# EasyEDA Pro project esp-streamer-schematics.epro

# Schematic Schematic1
Board Name: Board1; Create Date: 2025-04-21; Page Name: P1; Project Name: esp-streamer; Schematic Name: Schematic1; Update Date: 2025-04-25; Company: EasyEDA.com; Page Size: A4; Version: V1.0
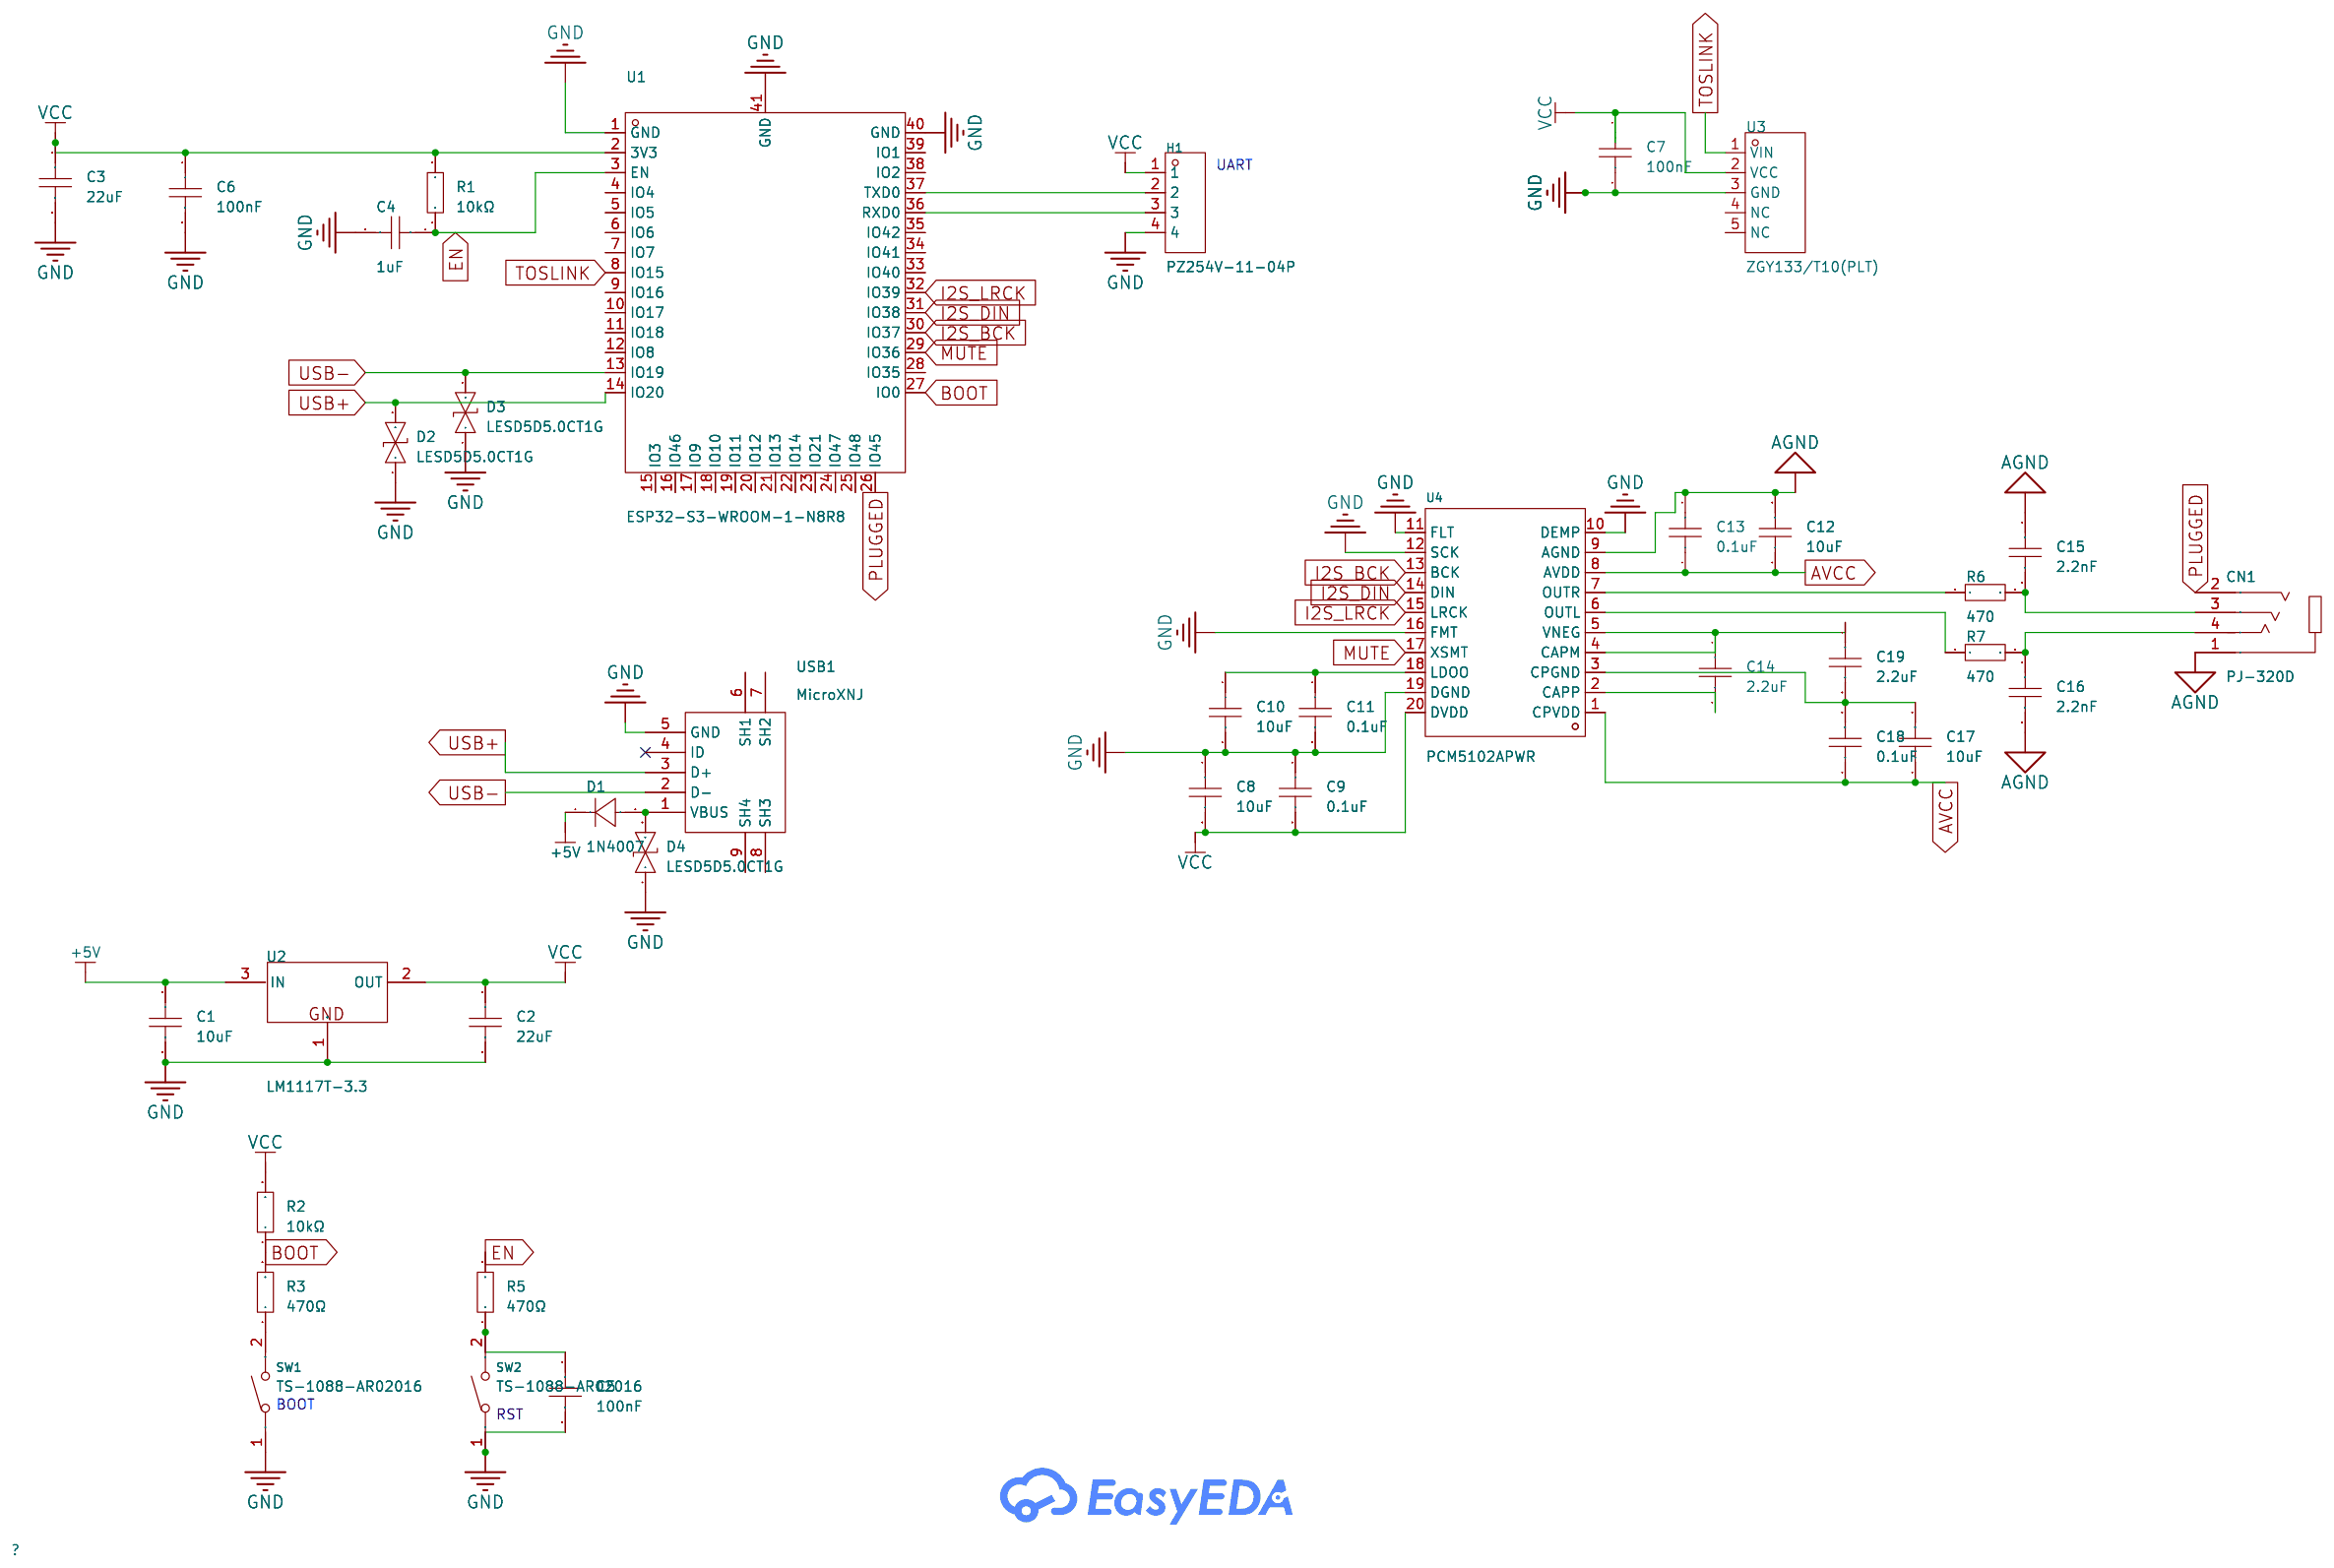
[diagram p0: schematic sheet]

## Parts
C1  10uF  [C0603]
C2  22uF  [C0603]
C3  22uF  [C0603]
C4  1uF  [C0603]
C5  100nF  [C0603]
C6  100nF  [C0603]
C7  100nF  [C0603]
C8  10uF  [C0603]
C9  0.1uF  [C0603]
C10  10uF  [C0603]
C11  0.1uF  [C0603]
C12  10uF  [C0603]
C13  0.1uF  [C0603]
C14  2.2uF  [C0603]
C15  2.2nF  [C0603]
C16  2.2nF  [C0603]
C17  10uF  [C0603]
C18  0.1uF  [C0603]
C19  2.2uF  [C0603]
CN1  PJ-320D  [AUDIO-SMD_PJ-320D]
D1  1N4007  [DO-41_BD2.4-L4.7-P8.70-D0.9-RD]
D2  LESD5D5.0CT1G  [SOD-523_L1.2-W0.8-LS1.6-BI]
D3  LESD5D5.0CT1G  [SOD-523_L1.2-W0.8-LS1.6-BI]
D4  LESD5D5.0CT1G  [SOD-523_L1.2-W0.8-LS1.6-BI]
H1  PZ254V-11-04P  [HDR-TH_4P-P2.54-V-M]
R1  10kΩ  [R0603]
R2  10kΩ  [R0603]
R3  470Ω  [R0603]
R5  470Ω  [R0603]
R6  470  [R0603]
R7  470  [R0603]
SW1  TS-1088-AR02016  [SW-SMD_L3.9-W3.0-P4.45]
SW2  TS-1088-AR02016  [SW-SMD_L3.9-W3.0-P4.45]
U1  ESP32-S3-WROOM-1-N8R8  [WIRELM-SMD_ESP32-S3-WROOM-1]
U2  LM1117T-3.3  [TO-220-3_L10.0-W4.5-P2.54-L]
U3  ZGY133/T10(PLT)  [COMM-TH_ZGY133-T10-PLT]
U4  PCM5102APWR  [TSSOP-20_L6.5-W4.4-P0.65-LS6.4-BL]
USB1  MicroXNJ  [MICRO-USB-SMD_MICROXNJ]

## Library data of the parts
C1 = CL10A106KP8NNNC: Capacitance: Tolerance:±10% Tolerance:±10% Voltage Rated: Temperature Coefficient:; LCSC Part Name: 10uF ±10% 10V; Supplier Part: C19702; Manufacturer: SAMSUNG(三星); Supplier Footprint: 0603; JLCPCB Part Class: Basic Part; Datasheet: https://atta.szlcsc.com/upload/public/pdf/source/20160218/1457707763339.pdf; Supplier: LCSC; Tolerance: ±10%
C2 C3 = CL10A226MQ8NRNC: Capacitance: Tolerance:±20% Tolerance:±20% Voltage Rated: Temperature Coefficient:; LCSC Part Name: 22uF ±20% 6.3V; Supplier Part: C59461; Manufacturer: SAMSUNG(三星); Supplier Footprint: 0603; JLCPCB Part Class: Basic Part; Datasheet: https://atta.szlcsc.com/upload/public/pdf/source/20160218/1457707763339.pdf; Supplier: LCSC; Tolerance: ±20%
C4 = CL10A105KB8NNNC: Capacitance: Tolerance:±10% Tolerance:±10% Voltage Rated: Temperature Coefficient:; LCSC Part Name: 1uF ±10% 50V; Supplier Part: C15849; Manufacturer: SAMSUNG(三星); Supplier Footprint: 0603; JLCPCB Part Class: Basic Part; Datasheet: https://atta.szlcsc.com/upload/public/pdf/source/20160218/1457707763339.pdf; Supplier: LCSC; Tolerance: ±10%
C5-C7 = CC0603KRX7R9BB104: Capacitance: Tolerance:±10% Tolerance:±10% Voltage Rated: Temperature Coefficient:; LCSC Part Name: 100nF ±10% 50V; Supplier Part: C14663; Manufacturer: YAGEO(国巨); Supplier Footprint: 0603; JLCPCB Part Class: Basic Part; Datasheet: https://atta.szlcsc.com/upload/public/pdf/source/20180910/C282072_33301C7F631E79921B82A8DAC6BCC5B3.pdf; Supplier: LCSC; Tolerance: ±10%
C8-C19 = CAP_0603: Supplier Footprint: 0603
CN1 = PJ-320D_C431535: Connector Type:3.5mm Headphone Jack Current Rating (Max):500mA Voltage Rating (Max):50V Contact Material:Copper Contact Plating:Silver Operating Temperature Range:-30℃~+70℃ Operating Temperature Range:-30℃~+70℃; LCSC Part Name: 3.5mm耳机座; Supplier Part: C431535; Manufacturer: SHOU HAN(首韩); Supplier Footprint: SMD; JLCPCB Part Class: Extended Part; Datasheet: https://atta.szlcsc.com/upload/public/pdf/source/20190925/C431535_8B274506621F6117FB020BF07A197848.pdf; Supplier: LCSC; Connector Type: 3.5mm Headphone Jack; Current Rating (Max): 500mA; Voltage Rating (Max): 50V; Contact Material: Copper; Contact Plating: Silver; Operating Temperature Range: -30℃~+70℃
D1 = 1N4007_C5280502: Voltage - Forward(Vf@If):- Voltage - DC Reverse(Vr):1kV Current - Rectified: Reverse Leakage Current (Ir):5uA; Supplier Part: C5280502; Manufacturer: XCH(旭昌辉); Supplier Footprint: DO-41; JLCPCB Part Class: Extended Part; Datasheet: https://atta.szlcsc.com/upload/public/pdf/source/20221209/078A147425187CB18B07AE1D756AAC46.pdf; Supplier: LCSC; Voltage - DC Reverse(Vr): 1kV; Reverse Leakage Current (Ir): 5uA
D2-D4 = LESD5D5.0CT1G: polarity:Bidirectional Reverse Stand-Off Voltage (Vrwm):5V Maximum Clamping Voltage:18.6V Peak Pulse Current (Ipp):9.4A Breakdown Voltage:5.6V Type:ESD; LCSC Part Name: 双向ESD; Supplier Part: C383211; Manufacturer: LRC(乐山无线电); Supplier Footprint: SOD-523; JLCPCB Part Class: Extended Part; Datasheet: https://atta.szlcsc.com/upload/public/pdf/source/20190807/C383211_633DF4B4E2C161403226E5235FE33A1C.pdf; Supplier: LCSC; polarity: Bidirectional; Reverse Stand-Off Voltage (Vrwm): 5V; Maximum Clamping Voltage: 18.6V; Peak Pulse Current (Ipp): 9.4A; Breakdown Voltage: 5.6V; Type: ESD
H1 = PZ254V-11-04P: Pin Structure:1x4P Pitch:2.54mm Row Spacing:- Circluar Pins/Square Pins:Square Pins Mounting Type:Straight Number of Rows:Plugin Number of Pins:4P Current Rating (Max):3A Voltage Rating (Max):250V Length of Mating Pin:6mm Insulation Height:2.5mm Length of; LCSC Part Name: 间距:2.54mm 1x4P 直插 方针; Supplier Part: C2691448; Manufacturer: XFCN(兴飞); Supplier Footprint: 插件,P=2.54mm; JLCPCB Part Class: Extended Part; Datasheet: https://atta.szlcsc.com/upload/public/pdf/source/20200309/C492403_F9F19131791D08044AD4F84F8E751A34.pdf; Supplier: LCSC; Pin Structure: 1x4P; Pitch: 2.54mm; Circluar Pins/Square Pins: Square Pins; Mounting Type: Straight; Number of Rows: Plugin; Number of Pins: 4P; Current Rating (Max): 3A; Voltage Rating (Max): 250V; Length of Mating Pin: 6mm; Insulation Height: 2.5mm; Length of End Connection Pin: 3mm; Operating Temperature Range: -40℃~+105℃; Color: Black
R1 R2 = 0603WAF1002T5E: Type:Thick Film Resistors Resistance:10kΩ Tolerance:±1% Tolerance:±1% Power(Watts): Overload Voltage (Max): Temperature Coefficient:±100ppm/℃ Temperature Coefficient:±100ppm/℃ Operating Temperature Range:-55℃~+155℃ Operating Temperature Range:-55℃~+155℃; LCSC Part Name: 厚膜电阻 10kΩ ±1% 100mW; Supplier Part: C25804; Manufacturer: UNI-ROYAL(厚声); Supplier Footprint: 0603; JLCPCB Part Class: Basic Part; Datasheet: https://atta.szlcsc.com/upload/public/pdf/source/20200306/C422600_1E6D84923E4A46A82E41ADD87F860B5C.pdf; Supplier: LCSC; Type: Thick Film Resistors; Tolerance: ±1%; Temperature Coefficient: ±100ppm/℃; Operating Temperature Range: -55℃~+155℃
R3 R5 = 0603WAF4700T5E: Type:Thick Film Resistors Resistance: Tolerance:±1% Tolerance:±1% Power(Watts): Overload Voltage (Max): Temperature Coefficient:±100ppm/℃ Temperature Coefficient:±100ppm/℃ Operating Temperature Range:-55℃~+155℃ Operating Temperature Range:-55℃~+155℃; LCSC Part Name: 470Ω ±1% 100mW 厚膜电阻; Supplier Part: C23179; Manufacturer: UNI-ROYAL(厚声); Supplier Footprint: 0603; JLCPCB Part Class: Basic Part; Datasheet: https://atta.szlcsc.com/upload/public/pdf/source/20200306/C422600_1E6D84923E4A46A82E41ADD87F860B5C.pdf; Supplier: LCSC; Type: Thick Film Resistors; Tolerance: ±1%; Temperature Coefficient: ±100ppm/℃; Operating Temperature Range: -55℃~+155℃
R6 R7 = Res_0603: Supplier Footprint: 0603
SW1 SW2 = TS-1088-AR02016: Circuit:SPST Actuator Style:Round Button Operating Force:160gf Mounting Style:Brick nogging Switch Length:4mm Switch Width:3mm Switch Height:2mm Strike Gundam:不带 Contact Current:50mA Voltage Rating (DC):12V Insulation Resistance:100MΩ Actuator/Cap Color:B; LCSC Part Name: 4*3*2mm 立贴 轻触开关; Supplier Part: C720477; Manufacturer: XUNPU(讯普); Supplier Footprint: SMD; JLCPCB Part Class: Extended Part; Datasheet: https://atta.szlcsc.com/upload/public/pdf/source/20200810/C720475_60D09DD6C54279ADDB2DC25100F1CC11.pdf; Supplier: LCSC; Circuit: SPST; Actuator Style: Round Button; Operating Force: 160gf; Mounting Style: Brick nogging; Switch Length: 4mm; Switch Width: 3mm; Switch Height: 2mm; Strike Gundam: 不带; Contact Current: 50mA; Voltage Rating (DC): 12V; Insulation Resistance: 100MΩ; Actuator/Cap Color: Black; Pin Style: SMDSplicing; Mechanical Life: 10万次; Operating Temperature: -30℃~+80℃
U1 = ESP32-S3-WROOM-1-N8R8: Supplier Part: C2913201; Manufacturer: ESPRESSIF(乐鑫); Supplier Footprint: SMD,25.5x18mm; JLCPCB Part Class: Extended Part; Datasheet: https://atta.szlcsc.com/upload/public/pdf/source/20241030/6A412B13087E1327DF6279F5735253CA.pdf; Supplier: LCSC
U2 = LM1117T-3.3: Output Type:Fixed Voltage - Supply:15V Output Voltage:3.3V Output Voltage:3.3V Output Current:1A Power Supply Rejection Ratio (PSRR):75dB@(120Hz) Features:热关断(TSD)；Overcurrent Protection(OCP) Operating Temperature:-40℃~+125℃@(Tj) Operating Temperature:-40; Supplier Part: C498321; Manufacturer: HGSEMI(华冠); Supplier Footprint: TO-220; JLCPCB Part Class: Extended Part; Datasheet: https://atta.szlcsc.com/upload/public/pdf/source/20201010/C498321_A78C1BC049E2A9ED534DA1D4E5758433.pdf; Supplier: LCSC; Output Type: Fixed; Voltage - Supply: 15V; Output Voltage: 3.3V; Output Current: 1A; Power Supply Rejection Ratio (PSRR): 75dB@(120Hz); Features: 热关断(TSD)；Overcurrent Protection(OCP); Operating Temperature: -40℃~+125℃@(Tj); Output Configuration: Positive electrode; Number of Outputs: 1
U3 = ZGY133/T10(PLT): Type:Fiber optic transmitter; LCSC Part Name: 光纤发送器; Supplier Part: C277782; Manufacturer: Chau Light(洲光源); Supplier Footprint: 插件; JLCPCB Part Class: Extended Part; Datasheet: https://atta.szlcsc.com/upload/public/pdf/source/20190227/C277782_E0ACCE48ABD726DF4B071E2AE6FB9474.pdf; Supplier: LCSC; Type: Fiber optic transmitter
U4 = PCM5102APWR: Interface Type:PCM Supply Voltage:1.65V~3.46V Supply Voltage:1.65V~3.46V Number of Channels:2 Resolution:24；16；32 Operating Temperature:-25℃~+85℃ Operating Temperature:-25℃~+85℃; Supplier Part: C107671; Manufacturer: TI(德州仪器); Supplier Footprint: TSSOP-20; JLCPCB Part Class: Extended Part; Datasheet: https://www.ti.com/cn/lit/gpn/pcm5102a; Supplier: LCSC; Interface Type: PCM; Supply Voltage: 1.65V~3.46V; Number of Channels: 2; Resolution: 24；16；32; Operating Temperature: -25℃~+85℃
USB1 = MicroXNJ: Connector Type:Micro-B Standard:USB 2.0 Gender:Female Mounting Style:Horizontal attachment Number of Contacts:5P Number of Ports:1 Current Rating - Power (Max):1.8A Operating Temperature Range:-20℃~+85℃ Operating Temperature Range:-20℃~+85℃ Rated Voltage; LCSC Part Name: Micro-B 母 卧贴; Supplier Part: C404969; Manufacturer: SHOU HAN(首韩); Supplier Footprint: SMD; JLCPCB Part Class: Extended Part; Datasheet: https://atta.szlcsc.com/upload/public/pdf/source/20220415/2494EDFF499AF6F852F7C820374B6AF3.pdf; Supplier: LCSC; Connector Type: Micro-B; Standard: USB 2.0; Gender: Female; Mounting Style: Horizontal attachment; Number of Contacts: 5P; Number of Ports: 1; Current Rating - Power (Max): 1.8A; Operating Temperature Range: -20℃~+85℃; Rated Voltage (Max): 30V; Connect-Disconnect Life: 5000 Cuts; Core Colour: Black

## Nets
+5V: C1.1 D1.1(K) U2.3(IN)
AGND: C12.2 C13.2 C15.1 C16.2 CN1.1 U4.9(AGND)
AVCC: C12.1 C13.1 C17.1 C18.1 U4.1(CPVDD) U4.8(AVDD)
GND: C1.2 C2.2 C3.2 C4.2 C5.2 C6.2 C7.2 C8.1 C9.1 C10.2 C11.2 D2.1 D3.1 D4.1 H1.4 SW1.1 SW2.1 U1.1(GND) U1.40(GND) U1.41(GND) U2.1(GND) U3.3(GND) U4.10(DEMP) U4.11(FLT) U4.12(SCK) U4.16(FMT) U4.19(DGND) USB1.5(GND)
VCC: C2.1 C3.1 C6.1 C7.1 C8.2 C9.2 H1.1 R1.2 R2.2 U1.2(3V3) U2.2(OUT) U3.2(VCC) U4.20(DVDD)
BOOT: R2.1 R3.2 U1.27(IO0)
EN: C4.1 R1.1 R5.2 U1.3(EN)
I2S_BCK: U1.30(IO37) U4.13(BCK)
I2S_DIN: U1.31(IO38) U4.14(DIN)
I2S_LRCK: U1.32(IO39) U4.15(LRCK)
MUTE: U1.29(IO36) U4.17(XSMT)
PLUGGED: CN1.2 U1.26(IO45)
TOSLINK: U1.8(IO15) U3.1(VIN)
USB+: D2.2 U1.14(IO20) USB1.3(D+)
USB-: D3.2 U1.13(IO19) USB1.2(D-)
Net-(C5-1): C5.1 R5.1 SW2.2
Net-(C10-1): C10.1 C11.1 U4.18(LDOO)
Net-(C14-1): C14.1 C19.1 U4.4(CAPM) U4.5(VNEG)
Net-(C14-2): C14.2 U4.2(CAPP)
Net-(C15-2): C15.2 CN1.3 R6.2
Net-(C16-1): C16.1 CN1.4 R7.2
Net-(C17-2): C17.2 C18.2 C19.2 U4.3(CPGND)
Net-(D1-2): D1.2(A) D4.2 USB1.1(VBUS)
Net-(H1-2): H1.2 U1.37(TXD0)
Net-(H1-3): H1.3 U1.36(RXD0)
Net-(R3-1): R3.1 SW1.2
Net-(R6-1): R6.1 U4.7(OUTR)
Net-(R7-1): R7.1 U4.6(OUTL)

Not connected (* = marked no-connect by the designer): U1 4(IO4) 5(IO5) 6(IO6) 7(IO7) 9(IO16) 10(IO17) 11(IO18) 12(IO8) 15(IO3) 16(IO46) 17(IO9) 18(IO10) 19(IO11) 20(IO12) 21(IO13) 22(IO14) 23(IO21) 24(IO47) 25(IO48) 28(IO35) 33(IO40) 34(IO41) 35(IO42) 38(IO2) 39(IO1); U3 4(NC) 5(NC); USB1 4(ID)* 6(SH1) 7(SH2) 8(SH3) 9(SH4)

## Notes on the sheet
- UART
- BOOT
- RST
